# EAGLE design FP Schematic (EAGLE 9.5.2)
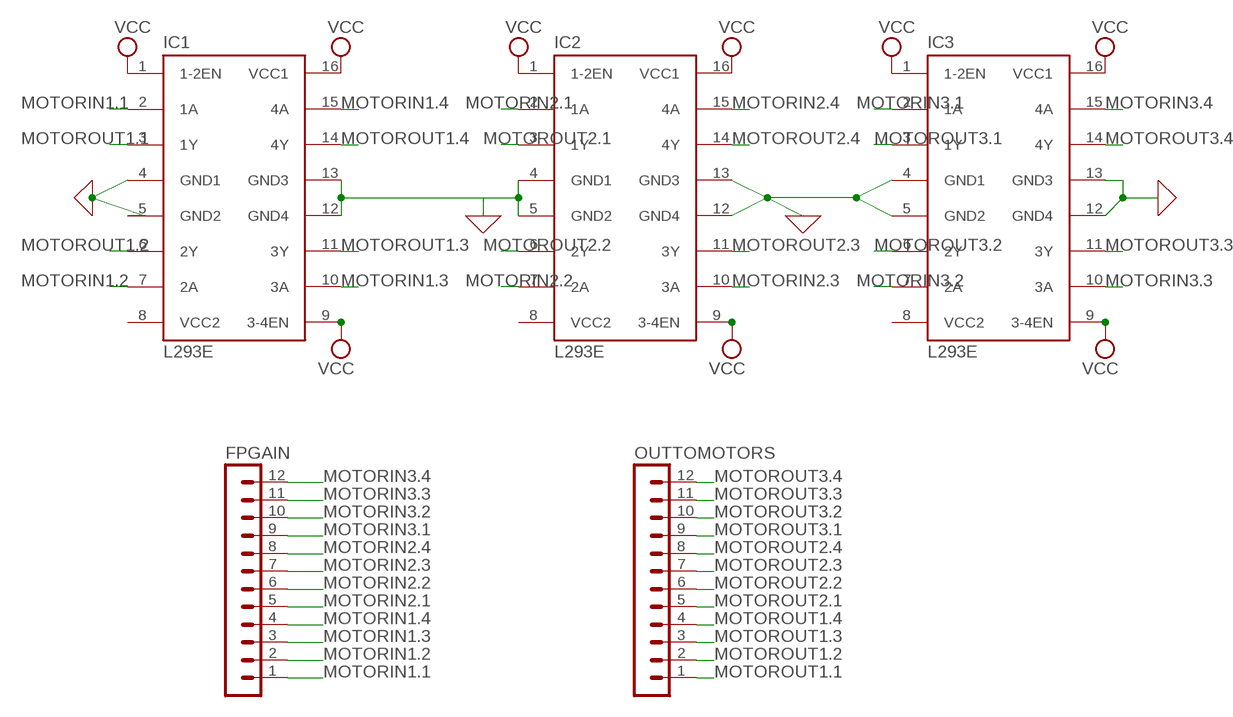
[diagram p0: schematic, sheet 1]

## Parts
FPGAIN  MA12-1  [MA12-1]
IC1  L293E  [DIL16]
IC2  L293E  [DIL16]
IC3  L293E  [DIL16]
OUTTOMOTORS  MA12-1  [MA12-1]

## Nets
0: IC1.4(GND1) IC1.5(GND2) IC1.12(GND4) IC1.13(GND3) IC2.4(GND1) IC2.5(GND2) IC2.12(GND4) IC2.13(GND3) IC3.4(GND1) IC3.5(GND2) IC3.12(GND4) IC3.13(GND3) ; supply symbol labelled GND
MOTORIN1.1: FPGAIN.1 IC1.2(1A)
MOTORIN1.2: FPGAIN.2 IC1.7(2A)
MOTORIN1.3: FPGAIN.3 IC1.10(3A)
MOTORIN1.4: FPGAIN.4 IC1.15(4A)
MOTORIN2.1: FPGAIN.5 IC2.2(1A)
MOTORIN2.2: FPGAIN.6 IC2.7(2A)
MOTORIN2.3: FPGAIN.7 IC2.10(3A)
MOTORIN2.4: FPGAIN.8 IC2.15(4A)
MOTORIN3.1: FPGAIN.9 IC3.2(1A)
MOTORIN3.2: FPGAIN.10 IC3.7(2A)
MOTORIN3.3: FPGAIN.11 IC3.10(3A)
MOTORIN3.4: FPGAIN.12 IC3.15(4A)
MOTOROUT1.1: IC1.3(1Y) OUTTOMOTORS.1
MOTOROUT1.2: IC1.6(2Y) OUTTOMOTORS.2
MOTOROUT1.3: IC1.11(3Y) OUTTOMOTORS.3
MOTOROUT1.4: IC1.14(4Y) OUTTOMOTORS.4
MOTOROUT2.1: IC2.3(1Y) OUTTOMOTORS.5
MOTOROUT2.2: IC2.6(2Y) OUTTOMOTORS.6
MOTOROUT2.3: IC2.11(3Y) OUTTOMOTORS.7
MOTOROUT2.4: IC2.14(4Y) OUTTOMOTORS.8
MOTOROUT3.1: IC3.3(1Y) OUTTOMOTORS.9
MOTOROUT3.2: IC3.6(2Y) OUTTOMOTORS.10
MOTOROUT3.3: IC3.11(3Y) OUTTOMOTORS.11
MOTOROUT3.4: IC3.14(4Y) OUTTOMOTORS.12
VCC: IC1.1(1-2EN) IC1.9(3-4EN) IC1.16(VCC1) IC2.1(1-2EN) IC2.9(3-4EN) IC2.16(VCC1) IC3.1(1-2EN) IC3.9(3-4EN) IC3.16(VCC1)

## Power pins joined to a net without a drawn wire
VCC2: IC1.8(VCC2) IC2.8(VCC2) IC3.8(VCC2)

## Library data of the parts
FPGAIN OUTTOMOTORS = con-lstb:MA12-1: PIN HEADER; OC_FARNELL: unknown; OC_NEWARK: unknown
IC1-IC3 = texas:L293E: TI DEVICE; MF: Arrow Electronics; MPN: L293E; OC_FARNELL: 1467711; OC_NEWARK: 89K0732

## Board
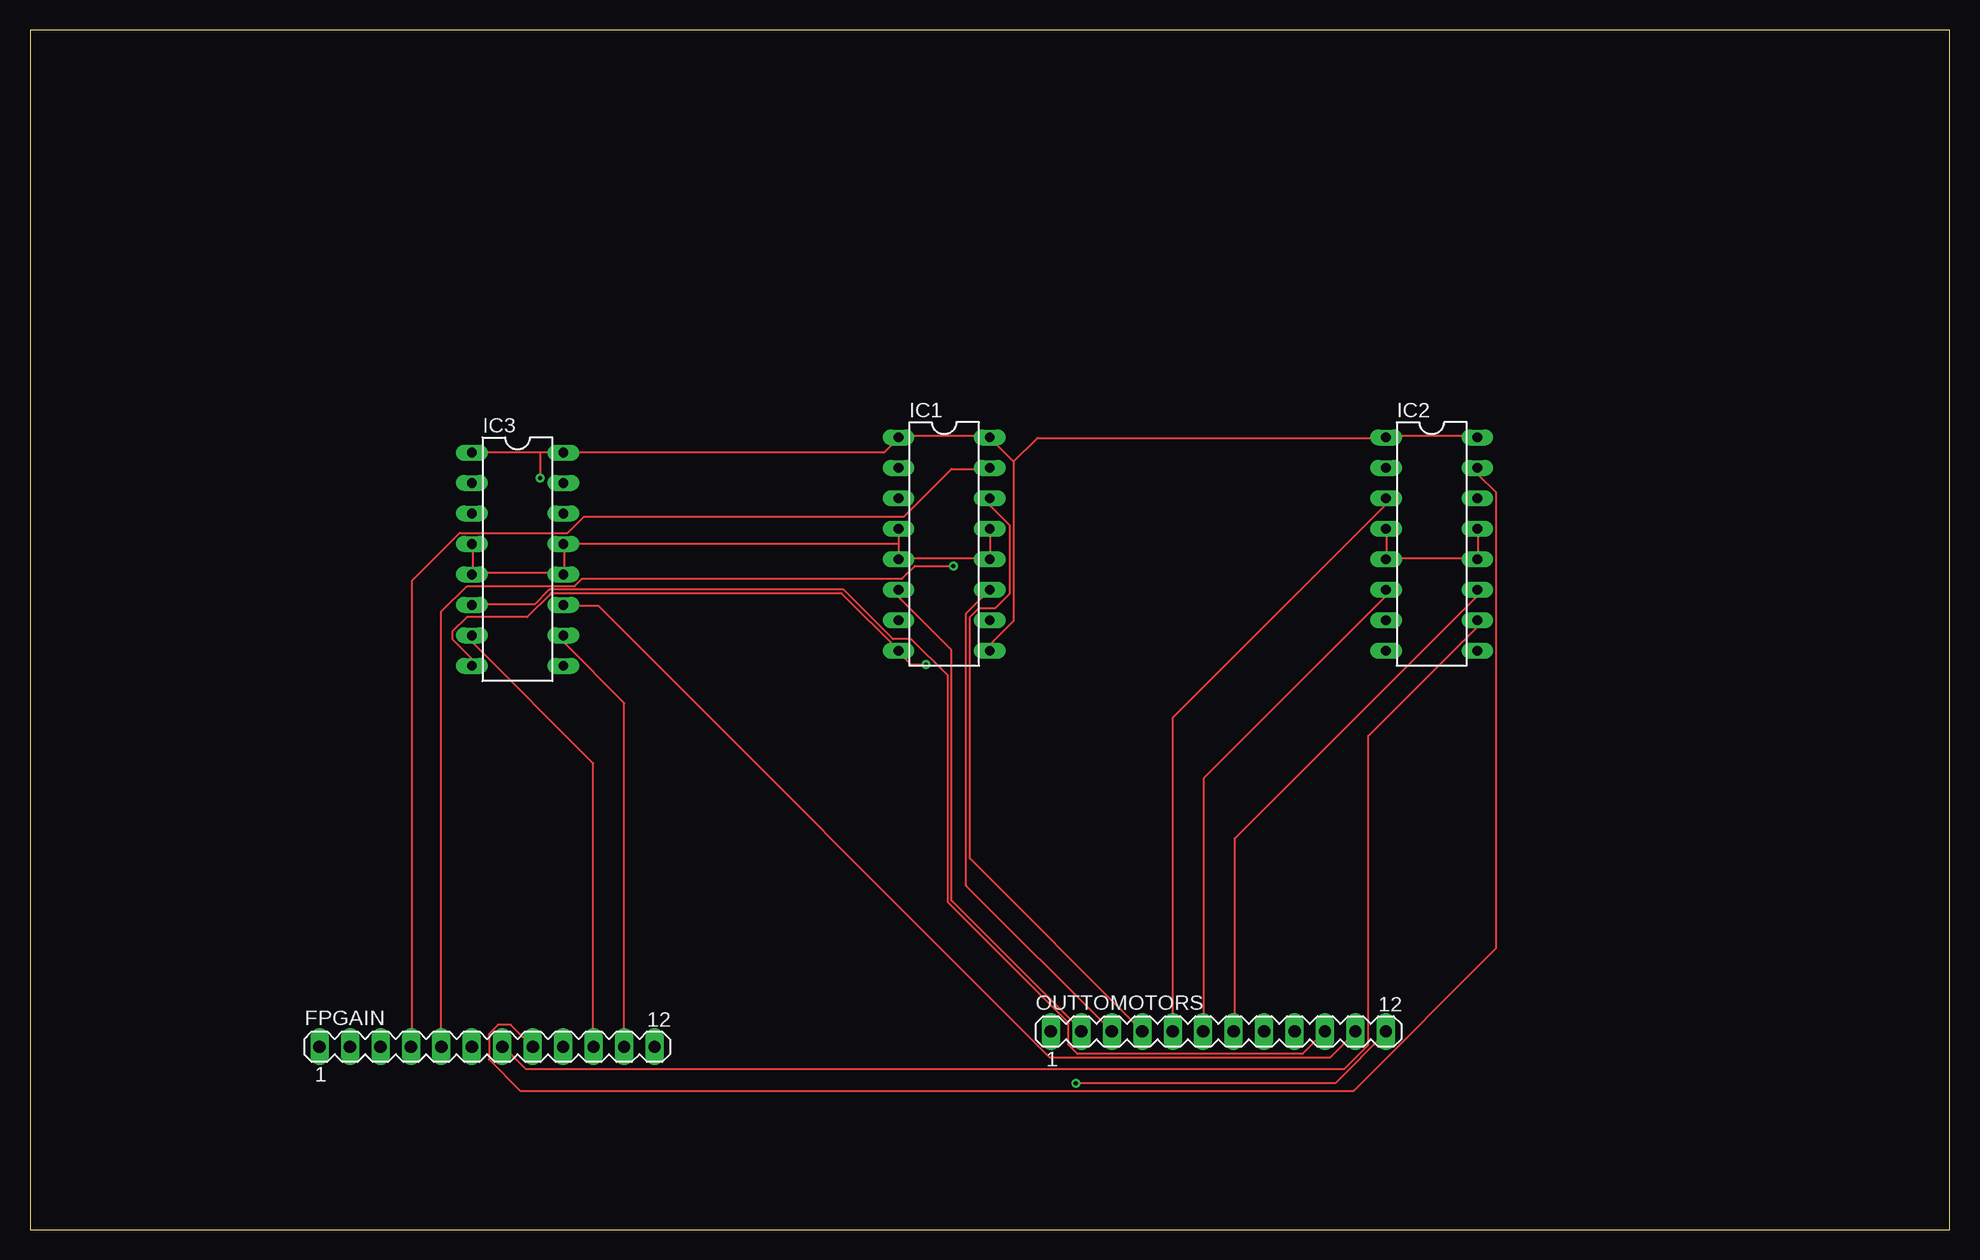
[diagram p1: board, top side]
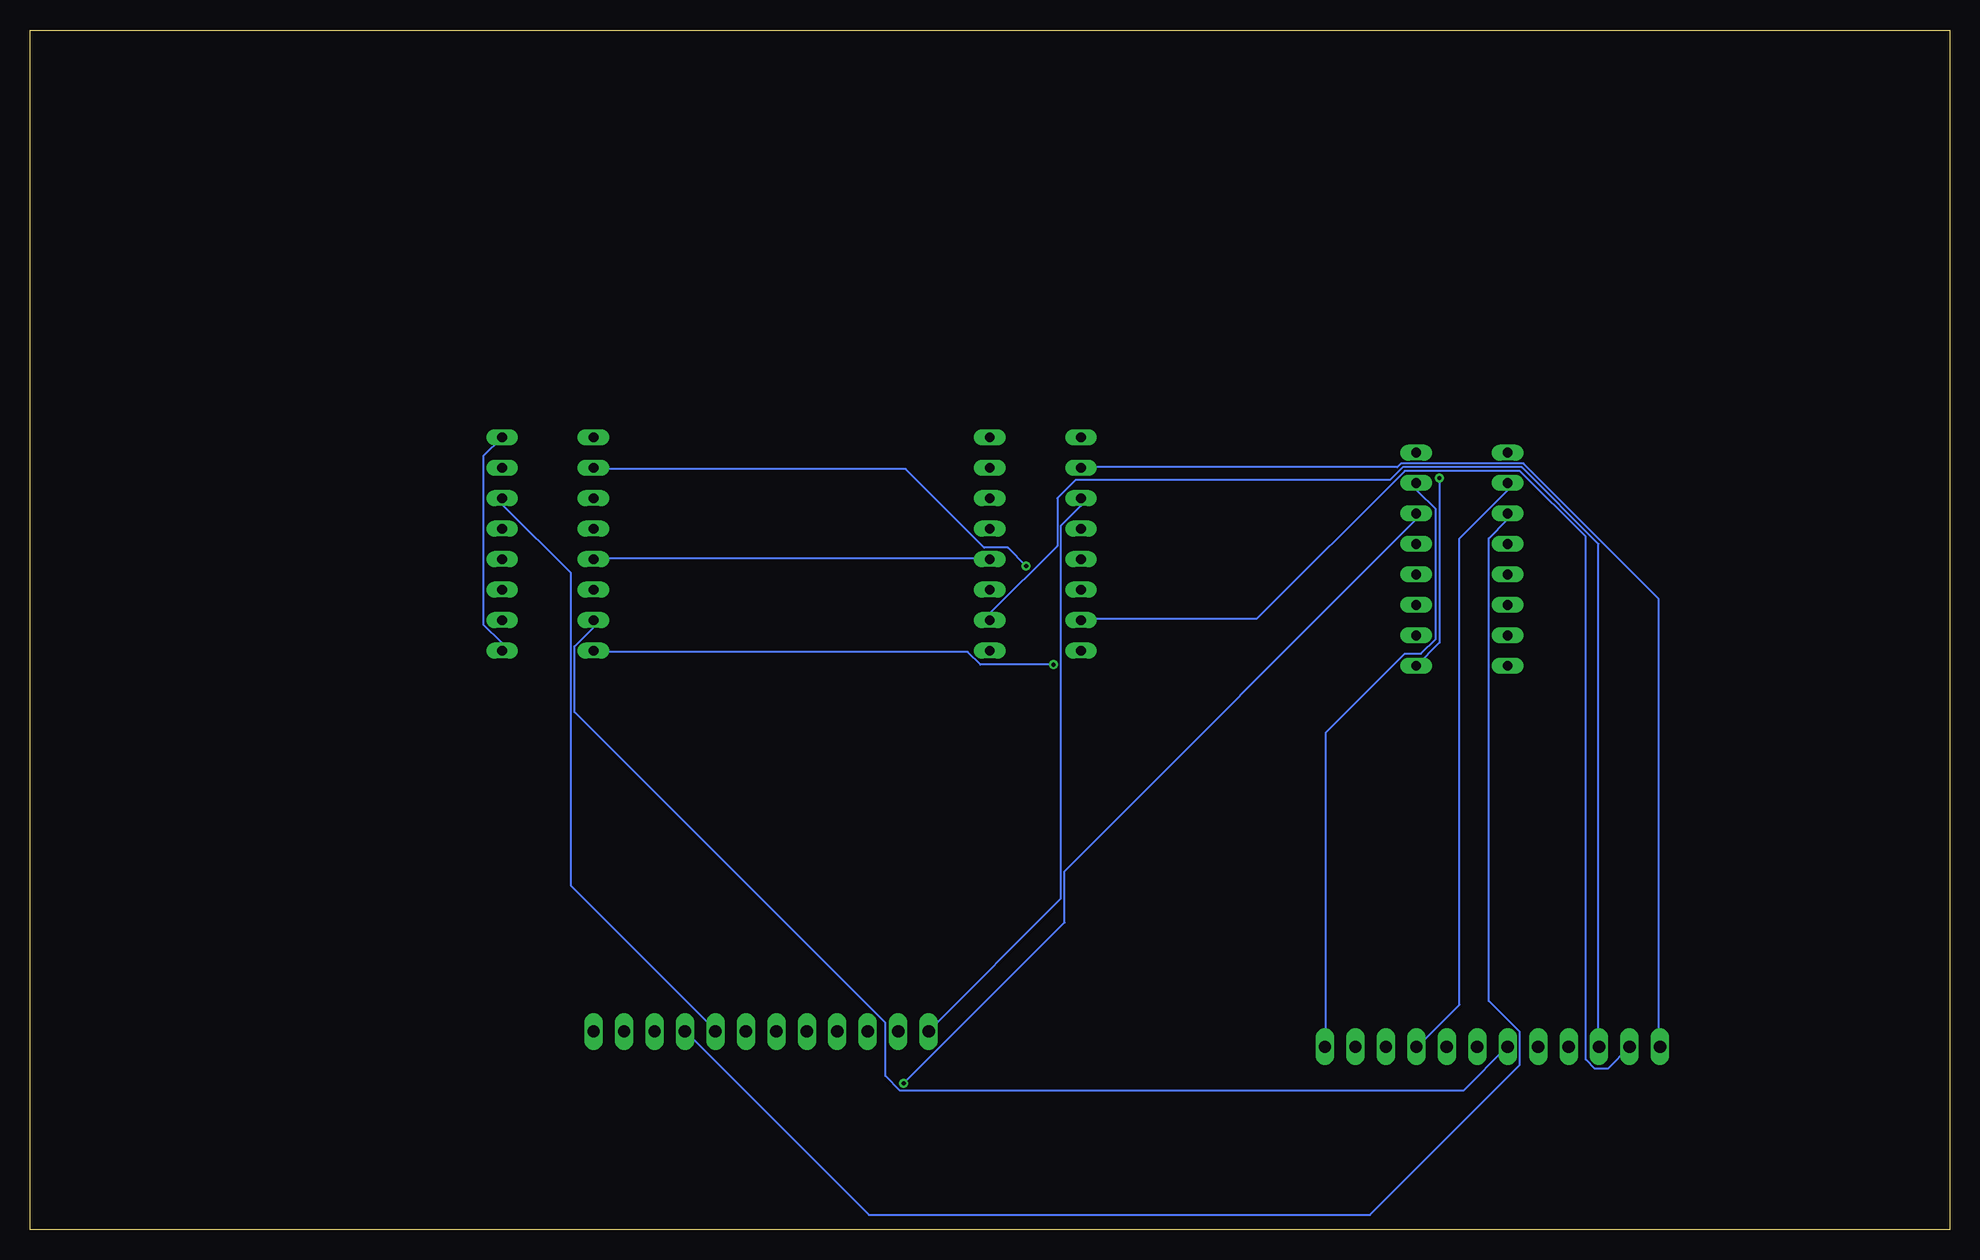
[diagram p2: board, bottom side, seen from below]

Size 160 x 100 mm. Coordinates in mm from the lower left corner, seen from the top.
Outline: 0,0 160,0 160,100 0,100 0,0
Copper layers (1*16): Top 0.035mm / dielectric 1.5mm / Bottom 0.035mm
Design rules "default": minimum track width 6mil, minimum drill 0.35mm, track to track 6mil, track to pad 6mil, pad to pad 6mil, via to via 6mil, smd to smd 6mil, copper to edge 40mil, drill to drill 6mil, minimum pad ring 10mil, minimum via ring 8mil, stop-mask expansion 4mil, vias tented up to drill 0mil, thermal gap 10mil

### Footprints (pad centres in the part's own frame; a part is rotated, then mirrored left to right if it is on the bottom)
MA12-1 = drill 1.016 long: 1 -13.97,0; 2 -11.43,0; 3 -8.89,0; 4 -6.35,0; 5 -3.81,0; 6 -1.27,0; 7 1.27,0; 8 3.81,0; 9 6.35,0; 10 8.89,0; 11 11.43,0; 12 13.97,0
DIL16 = drill 0.813 long: 1 -8.89,-3.81; 2 -6.35,-3.81; 3 -3.81,-3.81; 4 -1.27,-3.81; 5 1.27,-3.81; 6 3.81,-3.81; 7 6.35,-3.81; 8 8.89,-3.81; 9 8.89,3.81; 10 6.35,3.81; 11 3.81,3.81; 12 1.27,3.81; 13 -1.27,3.81; 14 -3.81,3.81; 15 -6.35,3.81; 16 -8.89,3.81

### Placement (x,y rotation side)
FPGAIN  38.1,15.24 0 top
IC1  76.2,57.15 270 top
IC2  116.84,57.15 270 top
IC3  40.64,55.88 270 top
OUTTOMOTORS  99.06,16.51 0 top

### Tracks (layer width: path | path; a pad name or v marks a point on that pad's centre or on a via)
0
  Top 0.152: 113.08,55.93 113.08,58.37 IC2.4 | IC2.13 120.7,58.37 120.7,55.93 IC2.12 120.55,55.93 113.08,55.93 | 113.08,55.93 IC2.5 | 36.88,54.71 36.88,57.15 IC3.4 | 44.5,57.15 44.5,54.71 IC3.12 44.35,54.71 36.88,54.71 | 36.88,54.71 IC3.5 | IC1.4 72.39,57.15 | 72.39,57.15 72.39,55.93 | IC1.13 80.01,55.93 | 80.01,55.93 72.39,55.93 | 72.39,55.93 IC1.5 | 80.01,55.93 IC1.12 | 72.39,57.15 44.5,57.15 | 44.5,57.15 IC3.13
  Bottom 0.152: IC2.5 112.93,55.93 80.01,55.93 IC1.12
MOTORIN1.1
  Bottom 0.152: IC1.2 72.39,63.55 46.02,63.55 45.72,63.86 35.51,63.86 24.23,52.58 24.23,15.24 FPGAIN.1
MOTORIN1.2
  Bottom 0.152: FPGAIN.2 28.5,13.41 29.57,13.41 30.33,14.17 30.33,57.76 35.81,63.25 45.41,63.25 57.76,50.9 72.39,50.9 IC1.7
MOTORIN1.3
  Bottom 0.152: IC1.10 80.01,51.36 74.37,57 74.37,60.96 72.85,62.48 46.63,62.48 45.57,63.55 35.66,63.55 29.26,57.15 29.26,15.24 FPGAIN.3
MOTORIN1.4
  Top 0.152: IC1.15 80.01,63.4 76.81,63.4 72.85,59.44 46.18,59.44 44.81,58.06 35.81,58.06 31.85,54.1 31.85,15.24 FPGAIN.4
MOTORIN2.1  (via drill 0.35)
  Top 0.152: v76.96,55.32 73.76,55.32 72.69,54.25 46.02,54.25 45.41,53.65 36.42,53.65 34.29,51.51 FPGAIN.5
  Bottom 0.152: v76.96,55.32 78.49,56.84 80.47,56.84 87.02,63.4 112.93,63.4 IC2.2
MOTORIN2.2
  Bottom 0.152: IC2.7 113.08,50.75 113.08,50.14 114.61,48.62 114.61,43.13 88.7,17.22 88.7,12.8 87.48,11.58 40.54,11.58 36.88,15.24 FPGAIN.6
MOTORIN2.3
  Top 0.152: IC2.10 120.55,50.75 120.55,50.14 111.56,41.15 111.56,15.39 109.58,13.41 41.3,13.41 39.47,15.24 FPGAIN.7
MOTORIN2.4
  Top 0.152: FPGAIN.8 40.08,17.07 39.01,17.07 38.25,16.31 38.25,14.17 40.84,11.58 110.34,11.58 122.22,23.47 122.22,61.42 120.7,62.94 120.7,63.4 IC2.15
MOTORIN3.1
  Bottom 0.152: IC3.2 36.88,62.18 36.88,61.57 40.84,57.61 40.84,18.75 44.35,15.24 FPGAIN.9
MOTORIN3.2
  Top 0.152: IC3.7 36.88,49.53 36.88,48.92 46.94,38.86 46.94,15.24 FPGAIN.10
MOTORIN3.3
  Top 0.152: FPGAIN.11 49.53,43.89 44.5,48.92 44.5,49.53 IC3.10
MOTORIN3.4
  Bottom 0.152: IC3.15 44.35,62.18 44.35,61.57 42.82,60.05 42.82,49.23 44.04,48.01 45.41,48.01 51.97,41.45 51.97,15.24 FPGAIN.12
MOTOROUT1.1
  Bottom 0.152: IC1.3 72.39,60.35 74.07,58.67 74.07,27.58 85.04,16.61 OUTTOMOTORS.1
MOTOROUT1.2
  Top 0.152: IC1.6 72.39,52.73 76.81,48.31 76.81,27.43 87.63,16.61 OUTTOMOTORS.2
MOTOROUT1.3
  Top 0.152: IC1.11 78.03,51.36 78.03,28.65 OUTTOMOTORS.3
MOTOROUT1.4
  Top 0.152: IC1.14 80.01,60.35 81.69,58.67 81.69,53.03 80.47,51.82 79.1,51.82 78.33,51.05 78.33,30.94 92.66,16.61 OUTTOMOTORS.4
MOTOROUT2.1
  Top 0.152: OUTTOMOTORS.5 95.25,42.67 112.93,60.35 112.93,60.96 IC2.3
MOTOROUT2.2
  Top 0.152: IC2.6 112.93,53.34 112.93,52.73 97.84,37.64 97.84,16.61 OUTTOMOTORS.6
MOTOROUT2.3
  Top 0.152: IC2.11 120.55,53.34 120.55,52.73 100.43,32.61 100.43,16.61 OUTTOMOTORS.7
MOTOROUT2.4
  Bottom 0.152: IC2.14 120.55,60.96 120.55,60.35 114.91,54.71 114.91,28.65 102.87,16.61 OUTTOMOTORS.8
MOTOROUT3.1
  Bottom 0.152: IC3.3 36.88,59.59 36.88,59.13 38.41,57.61 38.41,19.05 35.81,16.46 35.81,13.72 48.31,1.22 90.07,1.22 105.31,16.46 OUTTOMOTORS.9
MOTOROUT3.2
  Top 0.152: OUTTOMOTORS.10 106.07,14.63 87.33,14.63 86.56,15.39 86.56,17.22 76.5,27.28 76.5,46.18 73.46,49.23 71.93,49.23 67.82,53.34 43.28,53.34 42.06,52.12 36.88,52.12 IC3.6
MOTOROUT3.3
  Top 0.152: IC3.11 44.5,51.97 47.4,51.97 85.04,14.33 108.36,14.33 110.49,16.46 OUTTOMOTORS.11
MOTOROUT3.4  (via drill 0.35)
  Top 0.152: v87.17,12.19 108.81,12.19 113.08,16.46 OUTTOMOTORS.12
  Bottom 0.152: v87.17,12.19 73.76,25.6 73.76,29.87 44.5,59.13 44.5,59.59 IC3.14
VCC  (via drill 0.35)
  Top 0.152: IC2.16 120.55,66.14 113.08,66.14 IC2.1 112.93,65.99 83.97,65.99 81.99,64.01 | 42.52,64.77 IC3.16 71.17,64.77 72.39,65.99 IC1.1 72.39,66.14 80.01,66.14 IC1.16 80.01,65.99 81.99,64.01 | 42.52,64.77 IC3.1 | 42.52,64.77 v42.52,62.64 | IC1.9 80.01,48.77 81.99,50.75 81.99,64.01
  Bottom 0.152: IC2.16 122.22,64.47 122.22,50.44 120.7,48.92 120.7,48.31 IC2.9 | IC3.9 42.52,48.92 v42.52,62.64
VCC2  (via drill 0.35)
  Top 0.152: IC3.8 36.73,47.09 36.73,47.7 35.2,49.23 35.2,49.84 36.42,51.05 41.45,51.05 43.43,53.03 67.67,53.03 72.39,48.31 IC1.8 72.39,48.16 73.46,47.09 v74.68,47.09
  Bottom 0.152: v74.68,47.09 80.77,47.09 81.84,48.16 112.93,48.16 IC2.8